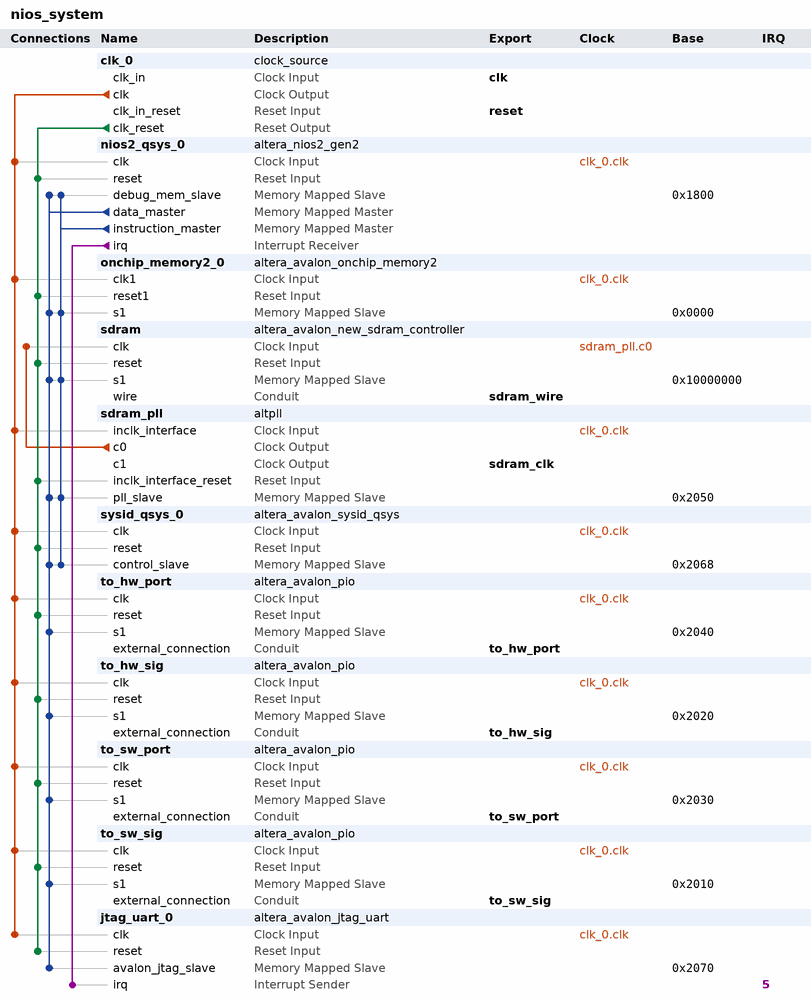
[diagram p0: system contents]
# Platform Designer (Qsys) system nios_system, Cyclone IV E EP4CE115F29C8
# Parameters at their usual value, and those the tool derives, are not listed.
package require -exact qsys 15.0
create_system nios_system
set_project_property DEVICE_FAMILY {Cyclone IV E}
set_project_property DEVICE EP4CE115F29C8

add_instance clk_0 clock_source 15.0
set_instance_parameter_value clk_0 clockFrequency 50000000

add_instance nios2_qsys_0 altera_nios2_gen2 15.0
set_instance_parameter_value nios2_qsys_0 dcache_size 2048
set_instance_parameter_value nios2_qsys_0 exceptionSlave sdram.s1
set_instance_parameter_value nios2_qsys_0 icache_size 4096
set_instance_parameter_value nios2_qsys_0 impl Tiny
set_instance_parameter_value nios2_qsys_0 resetSlave sdram.s1

add_instance onchip_memory2_0 altera_avalon_onchip_memory2 15.0
set_instance_parameter_value onchip_memory2_0 dataWidth 32
set_instance_parameter_value onchip_memory2_0 dualPort false
set_instance_parameter_value onchip_memory2_0 initMemContent true
set_instance_parameter_value onchip_memory2_0 initializationFileName onchip_mem.hex
set_instance_parameter_value onchip_memory2_0 memorySize 4096

add_instance sdram altera_avalon_new_sdram_controller 15.0
set_instance_parameter_value sdram TAC 5.5
set_instance_parameter_value sdram TRCD 20.0
set_instance_parameter_value sdram TRP 20.0
set_instance_parameter_value sdram casLatency 3
set_instance_parameter_value sdram columnWidth 10
set_instance_parameter_value sdram dataWidth 32
set_instance_parameter_value sdram generateSimulationModel false
set_instance_parameter_value sdram model single_Micron_MT48LC4M32B2_7_chip
set_instance_parameter_value sdram numberOfBanks 4
set_instance_parameter_value sdram numberOfChipSelects 1
set_instance_parameter_value sdram powerUpDelay 200.0
set_instance_parameter_value sdram refreshPeriod 7.8125
set_instance_parameter_value sdram rowWidth 13

add_instance sdram_pll altpll 15.0
set_instance_parameter_value sdram_pll CLK0_DIVIDE_BY 1
set_instance_parameter_value sdram_pll CLK0_MULTIPLY_BY 1
set_instance_parameter_value sdram_pll CLK1_DIVIDE_BY 1
set_instance_parameter_value sdram_pll CLK1_DUTY_CYCLE 50
set_instance_parameter_value sdram_pll CLK1_MULTIPLY_BY 1
set_instance_parameter_value sdram_pll CLK1_PHASE_SHIFT -3000
set_instance_parameter_value sdram_pll INCLK0_INPUT_FREQUENCY 20000
set_instance_parameter_value sdram_pll PORT_ARESET PORT_UNUSED
set_instance_parameter_value sdram_pll PORT_LOCKED PORT_UNUSED
set_instance_parameter_value sdram_pll PORT_clk1 PORT_USED
set_instance_parameter_value sdram_pll PORT_clk2 PORT_UNUSED
set_instance_parameter_value sdram_pll PORT_clk3 PORT_UNUSED

add_instance sysid_qsys_0 altera_avalon_sysid_qsys 15.0
set_instance_parameter_value sysid_qsys_0 id 0

add_instance to_hw_port altera_avalon_pio 15.0
set_instance_parameter_value to_hw_port direction Output
set_instance_parameter_value to_hw_port width 8

add_instance to_hw_sig altera_avalon_pio 15.0
set_instance_parameter_value to_hw_sig direction Output
set_instance_parameter_value to_hw_sig width 2

add_instance to_sw_port altera_avalon_pio 15.0
set_instance_parameter_value to_sw_port direction Input
set_instance_parameter_value to_sw_port width 8

add_instance to_sw_sig altera_avalon_pio 15.0
set_instance_parameter_value to_sw_sig direction Input
set_instance_parameter_value to_sw_sig width 2

add_instance jtag_uart_0 altera_avalon_jtag_uart 15.0
set_instance_parameter_value jtag_uart_0 simInteractiveOptions NO_INTERACTIVE_WINDOWS

# connections
add_connection clk_0.clk jtag_uart_0.clk clock
add_connection clk_0.clk nios2_qsys_0.clk clock
add_connection clk_0.clk onchip_memory2_0.clk1 clock
add_connection clk_0.clk sdram_pll.inclk_interface clock
add_connection clk_0.clk sysid_qsys_0.clk clock
add_connection clk_0.clk to_hw_port.clk clock
add_connection clk_0.clk to_hw_sig.clk clock
add_connection clk_0.clk to_sw_port.clk clock
add_connection clk_0.clk to_sw_sig.clk clock
add_connection sdram_pll.c0 sdram.clk clock
add_connection clk_0.clk_reset jtag_uart_0.reset reset
add_connection clk_0.clk_reset nios2_qsys_0.reset reset
add_connection clk_0.clk_reset onchip_memory2_0.reset1 reset
add_connection clk_0.clk_reset sdram.reset reset
add_connection clk_0.clk_reset sdram_pll.inclk_interface_reset reset
add_connection clk_0.clk_reset sysid_qsys_0.reset reset
add_connection clk_0.clk_reset to_hw_port.reset reset
add_connection clk_0.clk_reset to_hw_sig.reset reset
add_connection clk_0.clk_reset to_sw_port.reset reset
add_connection clk_0.clk_reset to_sw_sig.reset reset
add_connection nios2_qsys_0.data_master jtag_uart_0.avalon_jtag_slave avalon
set_connection_parameter_value nios2_qsys_0.data_master/jtag_uart_0.avalon_jtag_slave baseAddress 0x2070
add_connection nios2_qsys_0.data_master nios2_qsys_0.debug_mem_slave avalon
set_connection_parameter_value nios2_qsys_0.data_master/nios2_qsys_0.debug_mem_slave baseAddress 0x1800
add_connection nios2_qsys_0.data_master onchip_memory2_0.s1 avalon
set_connection_parameter_value nios2_qsys_0.data_master/onchip_memory2_0.s1 baseAddress 0x0000
add_connection nios2_qsys_0.data_master sdram.s1 avalon
set_connection_parameter_value nios2_qsys_0.data_master/sdram.s1 baseAddress 0x10000000
add_connection nios2_qsys_0.data_master sdram_pll.pll_slave avalon
set_connection_parameter_value nios2_qsys_0.data_master/sdram_pll.pll_slave baseAddress 0x2050
add_connection nios2_qsys_0.data_master sysid_qsys_0.control_slave avalon
set_connection_parameter_value nios2_qsys_0.data_master/sysid_qsys_0.control_slave baseAddress 0x2068
add_connection nios2_qsys_0.data_master to_hw_port.s1 avalon
set_connection_parameter_value nios2_qsys_0.data_master/to_hw_port.s1 baseAddress 0x2040
add_connection nios2_qsys_0.data_master to_hw_sig.s1 avalon
set_connection_parameter_value nios2_qsys_0.data_master/to_hw_sig.s1 baseAddress 0x2020
add_connection nios2_qsys_0.data_master to_sw_port.s1 avalon
set_connection_parameter_value nios2_qsys_0.data_master/to_sw_port.s1 baseAddress 0x2030
add_connection nios2_qsys_0.data_master to_sw_sig.s1 avalon
set_connection_parameter_value nios2_qsys_0.data_master/to_sw_sig.s1 baseAddress 0x2010
add_connection nios2_qsys_0.instruction_master nios2_qsys_0.debug_mem_slave avalon
set_connection_parameter_value nios2_qsys_0.instruction_master/nios2_qsys_0.debug_mem_slave baseAddress 0x1800
add_connection nios2_qsys_0.instruction_master onchip_memory2_0.s1 avalon
set_connection_parameter_value nios2_qsys_0.instruction_master/onchip_memory2_0.s1 baseAddress 0x0000
add_connection nios2_qsys_0.instruction_master sdram.s1 avalon
set_connection_parameter_value nios2_qsys_0.instruction_master/sdram.s1 baseAddress 0x10000000
add_connection nios2_qsys_0.instruction_master sdram_pll.pll_slave avalon
set_connection_parameter_value nios2_qsys_0.instruction_master/sdram_pll.pll_slave baseAddress 0x2050
add_connection nios2_qsys_0.instruction_master sysid_qsys_0.control_slave avalon
set_connection_parameter_value nios2_qsys_0.instruction_master/sysid_qsys_0.control_slave baseAddress 0x2068
add_connection nios2_qsys_0.irq jtag_uart_0.irq interrupt
set_connection_parameter_value nios2_qsys_0.irq/jtag_uart_0.irq irqNumber 5

# exported interfaces
add_interface clk clock sink
set_interface_property clk EXPORT_OF clk_0.clk_in
add_interface reset reset sink
set_interface_property reset EXPORT_OF clk_0.clk_in_reset
add_interface sdram_clk clock source
set_interface_property sdram_clk EXPORT_OF sdram_pll.c1
add_interface sdram_wire conduit end
set_interface_property sdram_wire EXPORT_OF sdram.wire
add_interface to_hw_port conduit end
set_interface_property to_hw_port EXPORT_OF to_hw_port.external_connection
add_interface to_hw_sig conduit end
set_interface_property to_hw_sig EXPORT_OF to_hw_sig.external_connection
add_interface to_sw_port conduit end
set_interface_property to_sw_port EXPORT_OF to_sw_port.external_connection
add_interface to_sw_sig conduit end
set_interface_property to_sw_sig EXPORT_OF to_sw_sig.external_connection

set_interconnect_requirement {$system} qsys_mm.clockCrossingAdapter HANDSHAKE
set_interconnect_requirement {$system} qsys_mm.enableEccProtection FALSE
set_interconnect_requirement {$system} qsys_mm.insertDefaultSlave FALSE
set_interconnect_requirement {$system} qsys_mm.maxAdditionalLatency 1

save_system nios_system.qsys
